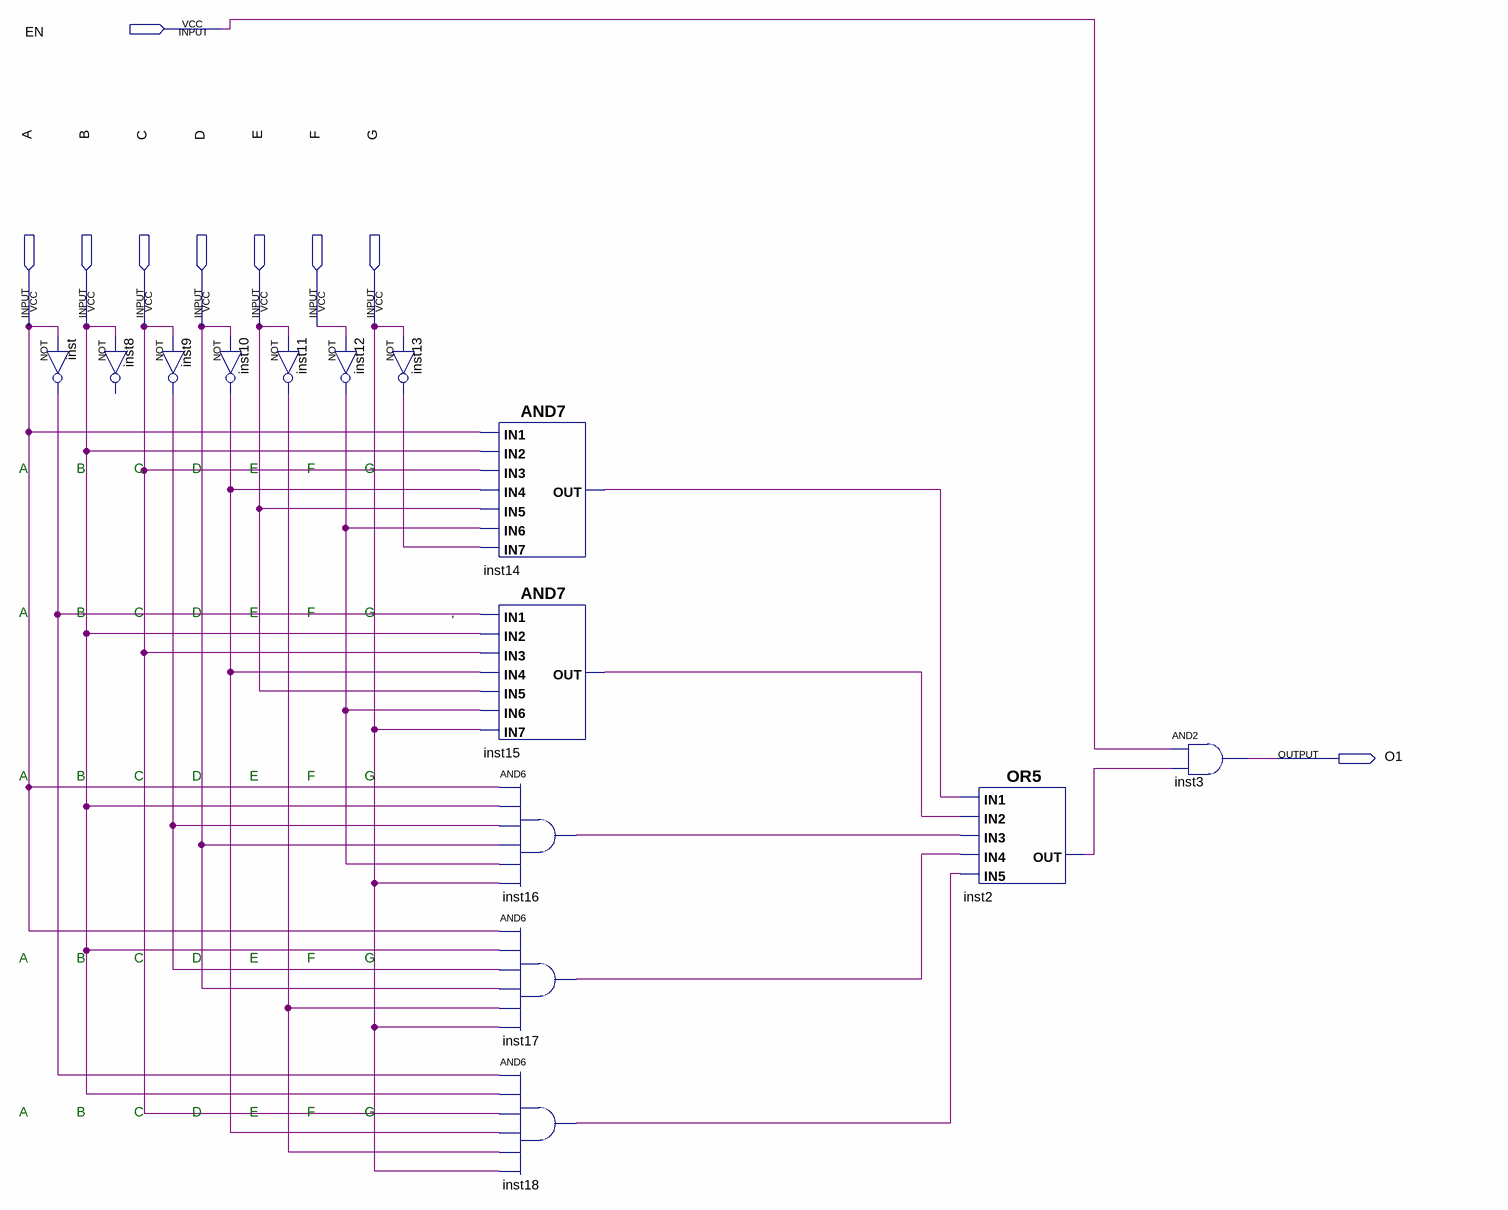
[diagram p0: schematic sheet]
// Quartus schematic linha3led3.bdf as structural Verilog: 14 symbols, 9 pins
module linha3led3 (
  input  EN,
  input  A,
  input  B,
  input  C,
  input  D,
  input  E,
  input  F,
  input  G,
  output O1
);

  wire inst2_out, inst9_out, inst10_out, inst11_out, inst12_out, inst13_out, inst14_out, inst15_out,
       inst16_out, inst17_out, inst18_out, inst_out;

  not inst (inst_out, A);
  // NOT inst8 has open pins: IN=B, OUT=open
  not inst9 (inst9_out, C);
  not inst10 (inst10_out, D);
  not inst11 (inst11_out, E);
  not inst12 (inst12_out, F);
  not inst13 (inst13_out, G);
  and inst14 (inst14_out, A, B, C, inst10_out, E, inst12_out, inst13_out);
  and inst15 (inst15_out, inst_out, B, C, inst10_out, E, inst12_out, G);
  and inst16 (inst16_out, A, B, inst9_out, D, inst12_out, G);
  and inst17 (inst17_out, A, B, inst9_out, D, inst11_out, G);
  and inst18 (inst18_out, inst_out, B, C, inst10_out, inst11_out, G);
  or inst2 (inst2_out, inst14_out, inst15_out, inst16_out, inst17_out, inst18_out);
  and inst3 (O1, EN, inst2_out);

  // Notes on the sheet:
  //   A
  //   B
  //   C
  //   D
  //   E
  //   F
  //   G
  //   A
  //   B
  //   C
  //   D
  //   E
  //   F
  //   G
  //   ,
  //   A
  //   B
  //   C
  //   D
  //   E
  //   F
  //   G
  //   A
  //   B
  //   C
  //   D
  //   E
  //   F
  //   G
  //   A
  //   B
  //   C
  //   D
  //   E
  //   F
  //   G
endmodule
